# EasyEDA Pro project ProPrj_3.3VBuck_1117_2024-12-16.epro

# Schematic 3.3VBuck_1117
Board Name: Board1; Create Date: 2024-12-15; Page Name: 3.3VBuck_1117_P1; Project Name: 3.3VBuck_1117; Schematic Name: 3.3VBuck_1117; Update Date: 2024-12-16; Company: 嘉立创EDA; Page Size: A4; Version: V1.0
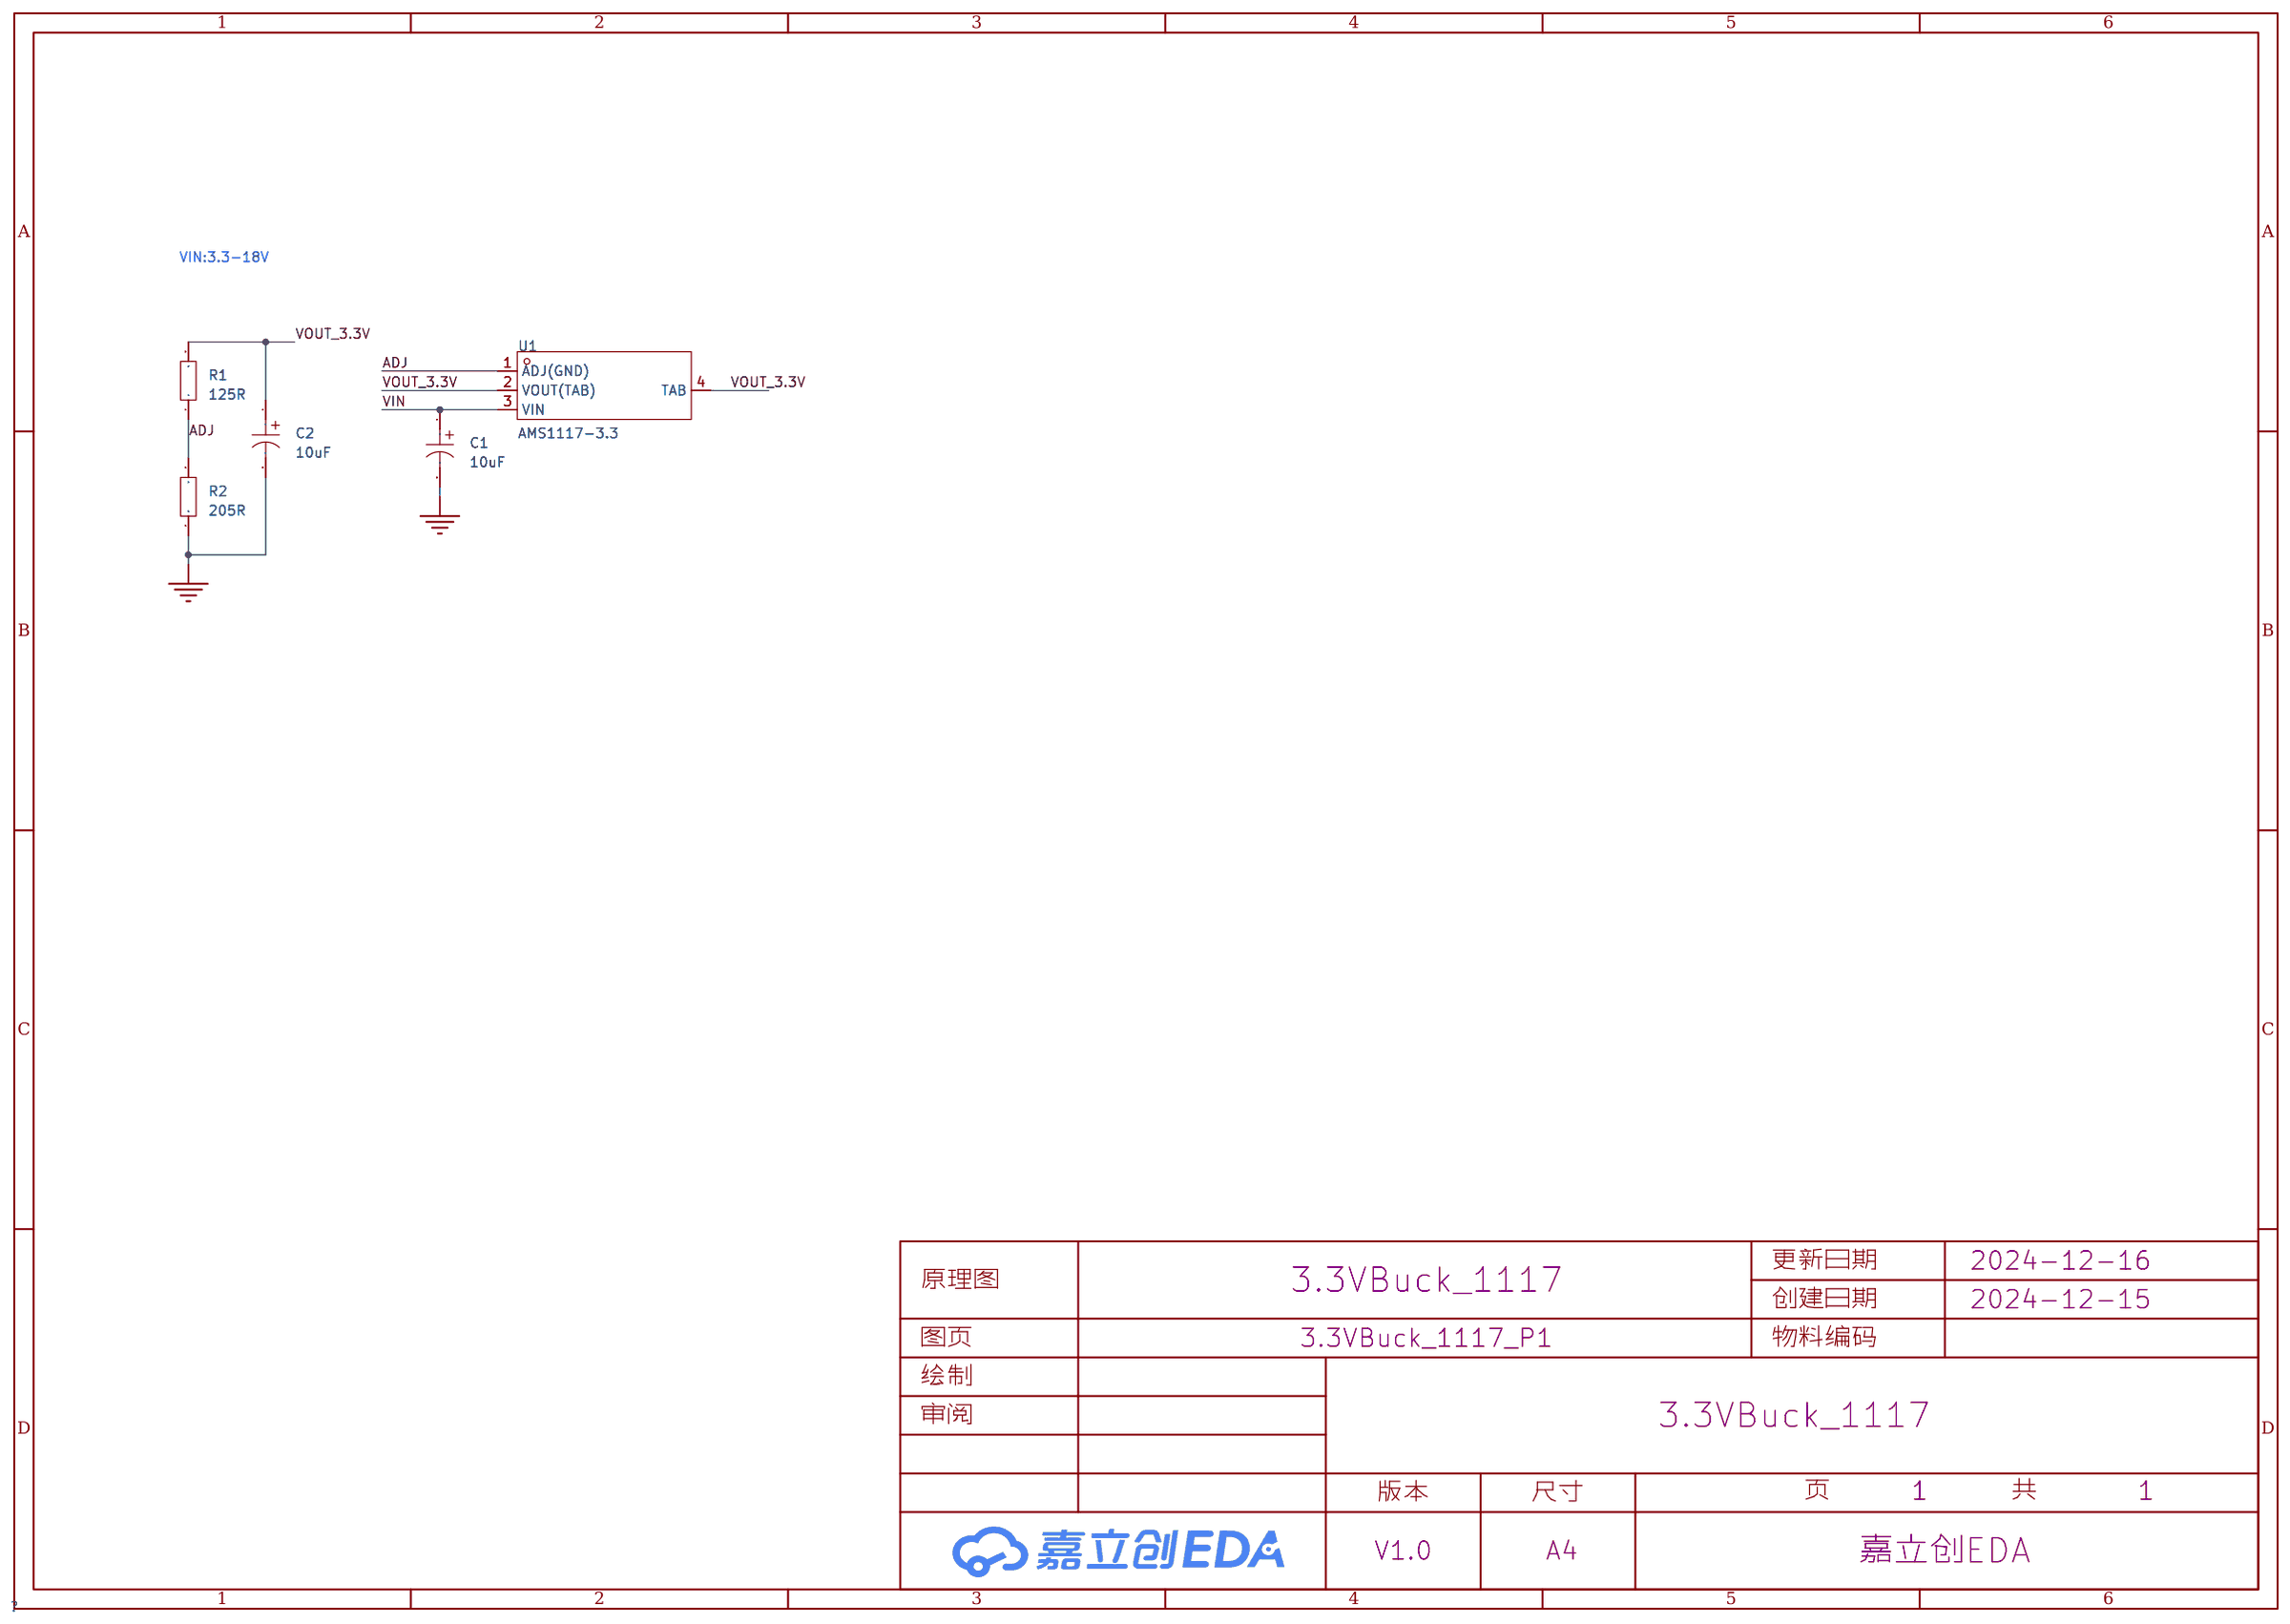
[diagram p0: schematic sheet]

## Parts
C1  10uF  [CAP-SMD_L2.0-W1.3-FD]
C2  10uF  [CAP-SMD_L2.0-W1.3-FD]
R1  125R  [R0805]
R2  205R  [R0805]
U1  AMS1117-3.3  [SOT-223-4_L6.5-W3.5-P2.30-LS7.0-BR]

## Library data of the parts
C1 C2 = TMCP1A106MTRF: 容值:10uF;精度:±20%;额定电压:10V;等效串联电阻:5.9Ω@100kHz;; LCSC Part Name: 10uF ±20% 10V; Supplier Part: C1969735; Manufacturer: VISHAY(威世); Supplier Footprint: 0805; JLCPCB Part Class: 扩展库; Datasheet: https://atta.szlcsc.com/upload/public/pdf/source/20210506/EB7F77920409F8D63FFE94178A7159DC.pdf; Supplier: LCSC; Tolerance: ±20%; Rated Voltage: 10V; Equivalent Series Resistance(ESR): 5.9Ω@100kHz; Operating Temperature: -55℃~+125℃
R1 R2 = Res_0805: Supplier Footprint: 0805
U1 = AMS1117-3.3_C347222: 输出类型:固定;最大输入电压:18V;输出电压:3.3V;输出电流:1A;电源纹波抑制比(PSRR):60dB@(120Hz);输出极性:正极;; LCSC Part Name: 输出:3.3V 电流:1A 耐压:12V; Supplier Part: C347222; Manufacturer: UMW(友台半导体); Supplier Footprint: SOT-223; JLCPCB Part Class: 扩展库; Datasheet: https://atta.szlcsc.com/upload/public/pdf/source/20231109/155D79A26D9DB04352555A58D5969DC8.pdf; Supplier: LCSC; Output Type: 固定; Maximum Input Voltage: 18V; Output Voltage: 3.3V; Output Current: 1A; Power Supply Rejection Ratio (PSRR): 60dB@(120Hz); Dropout Voltage: 1.3V@(1A); Feature: 过流保护(OCP); Output Polarity: 正极; Number of Outputs: 1

## Nets
GND: C1.2 C2.2 R2.1
VIN: C1.1 U1.3(VIN)
ADJ: R1.1 R2.2 U1.1(ADJ(GND))
VOUT_3.3V: C2.1 R1.2 U1.2(VOUT(TAB)) U1.4(TAB)

## Notes on the sheet
- VIN:3.3-18V

# Board 3.3VBuck_1117_joint
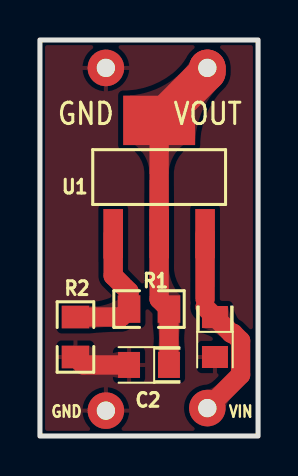
[diagram p1: board, top side]
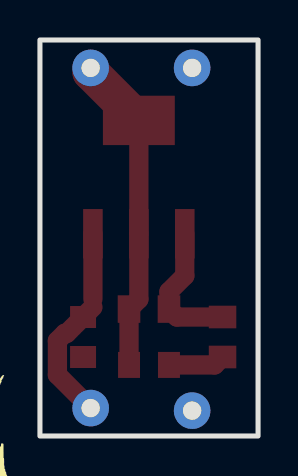
[diagram p2: board, bottom side, seen from below]

Outline 10.92 x 19.81 mm; copper layers: Top Layer, Bottom Layer. Coordinates in mm from the lower left corner of the outline.
Outline path: rectangle 0,19.81 10.92,0
Stack: Top Layer 0.035mm / Dielectric1 1.51mm FR4 er 4.5 / Bottom Layer 0.035mm

## Design rules (mm)
template: JLCPCB Capability(Two Layers Board)
spacing copperThickness1oz (default): track to track 0.102, other pairs 0.152 to 0.3
spacing copperThickness2oz: track to track 0.203, other pairs 0.152 to 0.3
track width copperThickness1oz (default): min 0.127, default 0.254, max 2.54
track width copperThickness2oz: min 0.203, default 0.254, max 2.54
differential pair differentialPair (default): width min 0.127, default 0.254, max 2.54; gap min 0.152, default 0.152
via viaSize (default): diameter min 0.5, default 0.61, max 10; hole min 0.3, default 0.305, max 6.3

## Placement (name value [footprint] x y rotation side)
C1  -  [CAP-SMD_L2.0-W1.3-FD]  8.76 4.95 270 top
C2  10uF  [CAP-SMD_L2.0-W1.3-FD]  5.46 3.56 180 top
NOREF  -  [Pad_e58]  8.38 1.4 0 top
NOREF#2  -  [Pad_e62]  3.3 18.41 0 top
NOREF#3  -  [Pad_e59]  3.3 1.27 0 top
NOREF#4  -  [Pad_e61]  8.38 18.41 0 top
R1  125R  [R0805]  5.46 6.35 0 top
R2  205R  [R0805]  1.78 4.95 90 top
U1  AMS1117-3.3  [SOT-223-4_L6.5-W3.5-P2.30-LS7.0-BR]  5.97 12.95 270 top

## Footprints (pads in the part's own frame, mm; a bottom-side part is the same pattern mirrored in y, then rotated)
CAP-SMD_L2.0-W1.3-FD
  rect 1.1x1.3 smd: 1(-1,0) 2(1,0)
Pad_e58
  round 1.829 hole 0.914: 1(0,0)
Pad_e59
  round 1.829 hole 0.914: 2(0,0)
Pad_e61
  round 1.829 hole 0.914: 1(0,0)
Pad_e62
  round 1.829 hole 0.914: 1(0,0)
R0805
  rect 1.133x1.377 smd: 1(-1,0) 2(1,0)
SOT-223-4_L6.5-W3.5-P2.30-LS7.0-BR
  rect 2.47x0.98 smd: 1(2.835,-2.3) 2(2.835,0) 3(2.835,2.3)
  rect 2.47x3.6 smd: 4(-2.835,0)

## Nets
GND: C1.2 C2.2 NOREF#2.1 NOREF#3.2 R2.1
VIN: C1.1 NOREF.1 U1.3
ADJ: R1.1 R2.2 U1.1
VOUT_3.3V: C2.1 NOREF#4.1 R1.2 U1.2 U1.4

## Routing (per net, layer and track width the routed paths; a pad name or vN(x,y) marks a point on that pad's centre or on a via; arc(x,y) is an arc through that point)
GND: length 2.8
  Top Layer w0.965: C2.2 2.17,3.56 R2.1
VIN: length 9.8
  Top Layer w0.965: 8.27,6.45 C1.1 9.58,5.14 9.68,5.14 10.05,4.77 10.05,3.06 NOREF.1 ; U1.3 8.27,6.86
ADJ: length 6.9
  Top Layer w0.965: U1.1 3.67,8.01 4.46,7.22 R1.1 4.06,5.95 R2.2
VOUT_3.3V: length 16.1
  Top Layer w0.965: U1.4 U1.2 5.97,6.84 R1.2 C2.1
  Top Layer w1.829: NOREF#4.1 8.38,18.2 U1.4

## Copper pours and planes (outline as drawn; the poured copper is in the pictures)
GND on Top Layer: -0.76,20.7 12.95,20.7 12.95,-1.27 -0.76,-1.27

Small or netless copper shapes (teardrops, artwork), in the pictures only: 16 on Top Layer

## Text on the board
Top Silkscreen Layer: VIN | GND | VOUT

# Board 3.3VBuck_1117
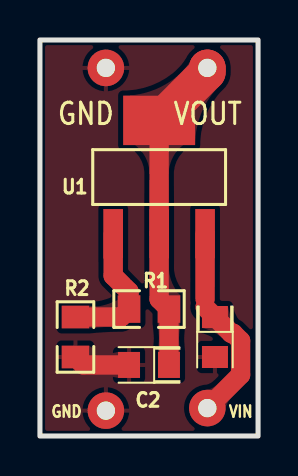
[diagram p3: board, top side]
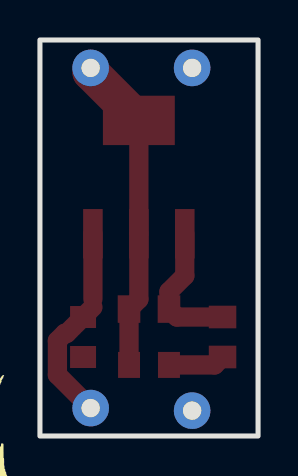
[diagram p4: board, bottom side, seen from below]

Outline 10.92 x 19.81 mm; copper layers: Top Layer, Bottom Layer. Coordinates in mm from the lower left corner of the outline.
Outline path: rectangle 0,19.81 10.92,0
Stack: Top Layer 0.035mm / Dielectric1 1.51mm FR4 er 4.5 / Bottom Layer 0.035mm

## Design rules (mm)
template: JLCPCB Capability(Two Layers Board)
spacing copperThickness1oz (default): track to track 0.102, other pairs 0.152 to 0.3
spacing copperThickness2oz: track to track 0.203, other pairs 0.152 to 0.3
track width copperThickness1oz (default): min 0.127, default 0.254, max 2.54
track width copperThickness2oz: min 0.203, default 0.254, max 2.54
differential pair differentialPair (default): width min 0.127, default 0.254, max 2.54; gap min 0.152, default 0.152
via viaSize (default): diameter min 0.5, default 0.61, max 10; hole min 0.3, default 0.305, max 6.3

## Placement (name value [footprint] x y rotation side)
C1  10uF  [CAP-SMD_L2.0-W1.3-FD]  8.76 4.95 270 top
C2  10uF  [CAP-SMD_L2.0-W1.3-FD]  5.46 3.56 180 top
NOREF  -  [Pad_e62]  3.3 18.41 0 top
NOREF#2  -  [Pad_e58]  8.38 1.4 0 top
NOREF#3  -  [Pad_e61]  8.38 18.41 0 top
NOREF#4  -  [Pad_e59]  3.3 1.27 0 top
R1  125R  [R0805]  5.46 6.35 0 top
R2  205R  [R0805]  1.78 4.95 90 top
U1  AMS1117-3.3  [SOT-223-4_L6.5-W3.5-P2.30-LS7.0-BR]  5.97 12.95 270 top

## Footprints (pads in the part's own frame, mm; a bottom-side part is the same pattern mirrored in y, then rotated)
CAP-SMD_L2.0-W1.3-FD
  rect 1.1x1.3 smd: 1(-1,0) 2(1,0)
Pad_e58
  round 1.829 hole 0.914: 1(0,0)
Pad_e59
  round 1.829 hole 0.914: 2(0,0)
Pad_e61
  round 1.829 hole 0.914: 1(0,0)
Pad_e62
  round 1.829 hole 0.914: 1(0,0)
R0805
  rect 1.133x1.377 smd: 1(-1,0) 2(1,0)
SOT-223-4_L6.5-W3.5-P2.30-LS7.0-BR
  rect 2.47x0.98 smd: 1(2.835,-2.3) 2(2.835,0) 3(2.835,2.3)
  rect 2.47x3.6 smd: 4(-2.835,0)

## Nets
GND: C1.2 C2.2 NOREF.1 NOREF#4.2 R2.1
VIN: C1.1 NOREF#2.1 U1.3
ADJ: R1.1 R2.2 U1.1
VOUT_3.3V: C2.1 NOREF#3.1 R1.2 U1.2 U1.4

## Routing (per net, layer and track width the routed paths; a pad name or vN(x,y) marks a point on that pad's centre or on a via; arc(x,y) is an arc through that point)
GND: length 2.8
  Top Layer w0.965: C2.2 2.17,3.56 R2.1
VIN: length 9.8
  Top Layer w0.965: NOREF#2.1 10.05,3.06 10.05,4.77 9.68,5.14 9.58,5.14 C1.1 8.27,6.45 ; U1.3 8.27,6.86
ADJ: length 6.9
  Top Layer w0.965: U1.1 3.67,8.01 4.46,7.22 R1.1 4.06,5.95 R2.2
VOUT_3.3V: length 16.1
  Top Layer w0.965: U1.4 U1.2 5.97,6.84 R1.2 C2.1
  Top Layer w1.829: U1.4 8.38,18.2 NOREF#3.1

## Copper pours and planes (outline as drawn; the poured copper is in the pictures)
GND on Top Layer: -0.76,20.7 12.95,20.7 12.95,-1.27 -0.76,-1.27

Small or netless copper shapes (teardrops, artwork), in the pictures only: 16 on Top Layer

## Text on the board
Top Silkscreen Layer: VIN | GND | VOUT
